# EAGLE design SEGmeter20XBeeShield (EAGLE 5.11)
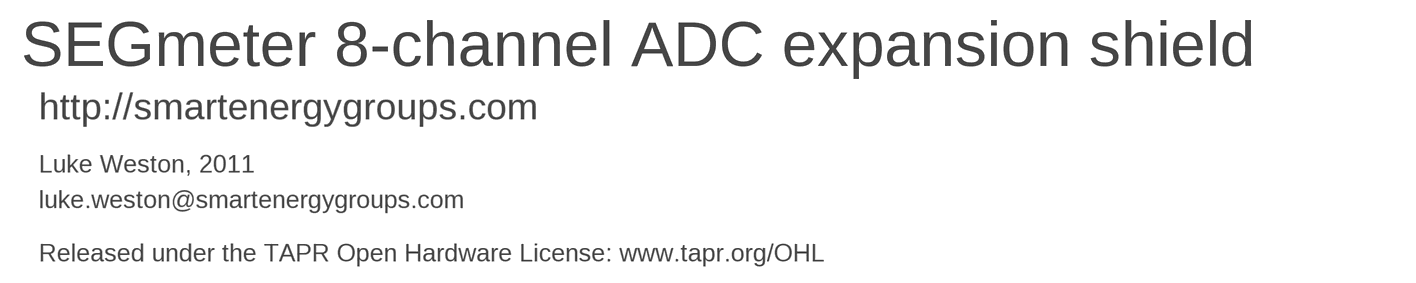
[diagram p0: schematic, sheet 1, part 1 of 3]
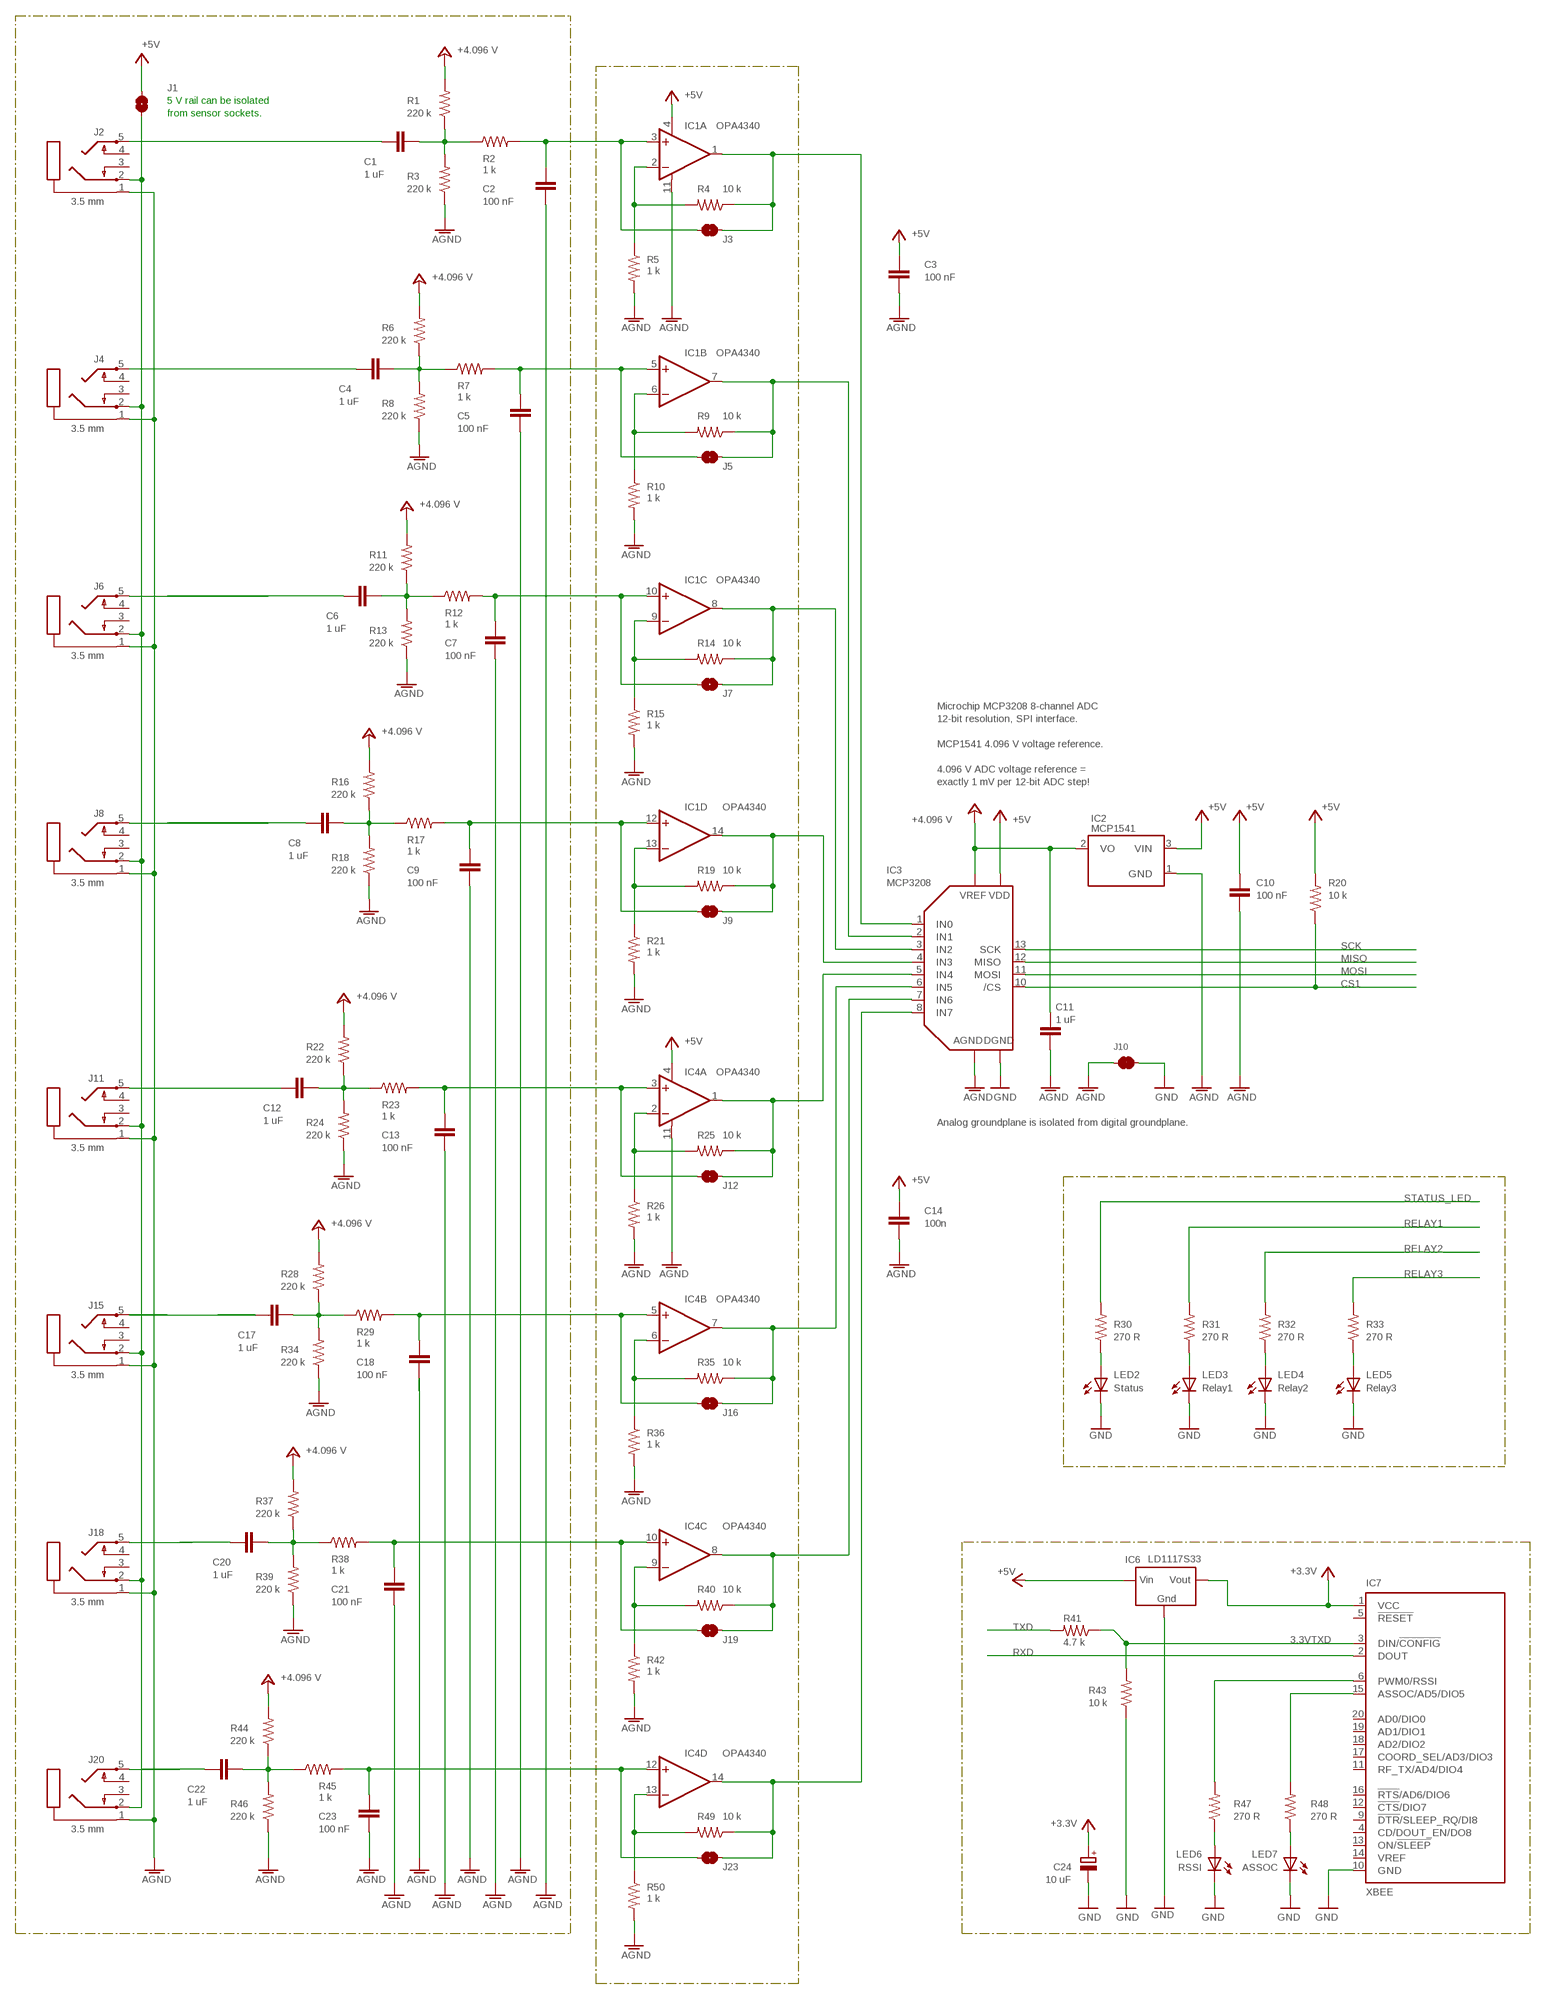
[diagram p1: schematic, sheet 1, part 2 of 3]
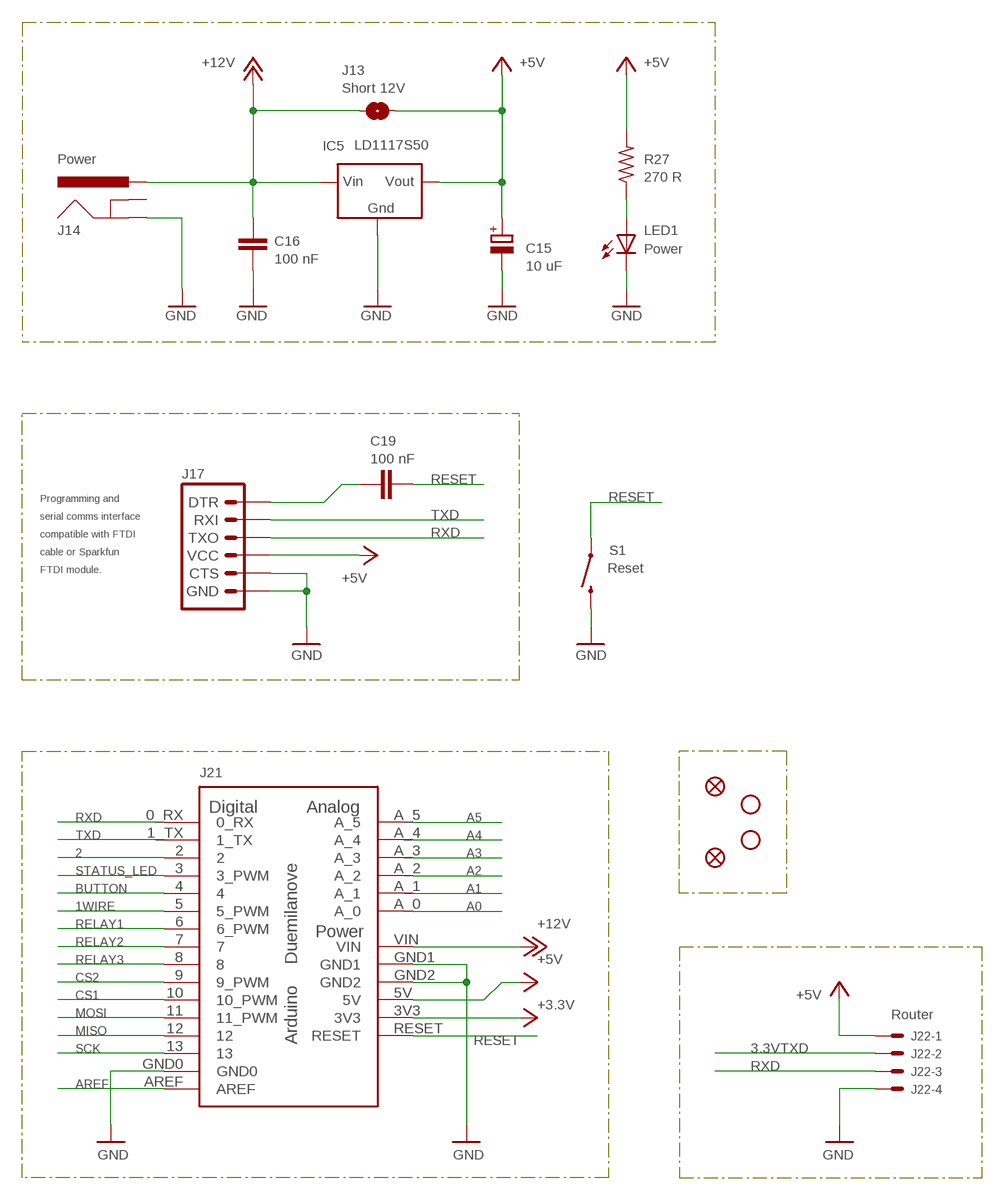
[diagram p2: schematic, sheet 1, part 3 of 3]

## Parts
C1  1 uF  C-EU050-024X044  [C050-024X044]
C2  100 nF  C-EU050-024X044  [C050-024X044]
C3  100 nF  C-EU050-024X044  [C050-024X044]
C4  1 uF  C-EU050-024X044  [C050-024X044]
C5  100 nF  C-EU050-024X044  [C050-024X044]
C6  1 uF  C-EU050-024X044  [C050-024X044]
C7  100 nF  C-EU050-024X044  [C050-024X044]
C8  1 uF  C-EU050-024X044  [C050-024X044]
C9  100 nF  C-EU050-024X044  [C050-024X044]
C10  100 nF  C-EU050-024X044  [C050-024X044]
C11  1 uF  C-EU050-024X044  [C050-024X044]
C12  1 uF  C-EU050-024X044  [C050-024X044]
C13  100 nF  C-EU050-024X044  [C050-024X044]
C14  100n  C-EU050-024X044  [C050-024X044]
C15  10 uF  CPOL-EUE2.5-5  [E2,5-5]
C16  100 nF  C-EU050-024X044  [C050-024X044]
C17  1 uF  C-EU050-024X044  [C050-024X044]
C18  100 nF  C-EU050-024X044  [C050-024X044]
C19  100 nF  C-EU050-024X044  [C050-024X044]
C20  1 uF  C-EU050-024X044  [C050-024X044]
C21  100 nF  C-EU050-024X044  [C050-024X044]
C22  1 uF  C-EU050-024X044  [C050-024X044]
C23  100 nF  C-EU050-024X044  [C050-024X044]
C24  10 uF  CPOL-EUE2.5-5  [E2,5-5]
IC1  OPA4340  OPA4340U  [SO14]
IC2  MCP1541  MC1541TO  [TO92]
IC3  MCP3208  [DIL16]
IC4  OPA4340  OPA4340U  [SO14]
IC5  LD1117S50  REG1117  [SOT223]
IC6  LD1117S33  REG1117  [SOT223]
IC7  XBEE  [XBEE-PRO]
J1  SJ  [SJ]
J2  3.5 mm  PG203J  [PG203J]
J3  SJ  [SJ]
J4  3.5 mm  PG203J  [PG203J]
J5  SJ  [SJ]
J6  3.5 mm  PG203J  [PG203J]
J7  SJ  [SJ]
J8  3.5 mm  PG203J  [PG203J]
J9  SJ  [SJ]
J10  SJ-NC  [SJ-NC]
J11  3.5 mm  PG203J  [PG203J]
J12  SJ  [SJ]
J13  Short 12V  SJ  [SJ]
J14  Power  POWER_JACKSLT  [POWER_JACK_SLOT]
J15  3.5 mm  PG203J  [PG203J]
J16  SJ  [SJ]
J17  Comms  ARDUINO_SERIAL_PROGRAMLONGPADS  [1X06_LONGPADS]
J18  3.5 mm  PG203J  [PG203J]
J19  SJ  [SJ]
J20  3.5 mm  PG203J  [PG203J]
J21  ARDUINO-USBNO-OUTLINE-NO-TEXT-OCTAGONAL  [NO-OUTLINE-OCTAGONAL-NOTEXT]
J22  Router  22-23-2041  [22-23-2041]
J23  SJ  [SJ]
JP1  FIDUCIAL1.5X3  [FIDUCIAL-1.5X3]
JP2  STAND-OFF  [STAND-OFF]
JP4  STAND-OFF  [STAND-OFF]
JP5  FIDUCIAL1.5X3  [FIDUCIAL-1.5X3]
LED1  Power  3MMLED  [3MMLED]
LED2  Status  3MMLED  [3MMLED]
LED3  Relay1  3MMLED  [3MMLED]
LED4  Relay2  3MMLED  [3MMLED]
LED5  Relay3  3MMLED  [3MMLED]
LED6  RSSI  3MMLED  [3MMLED]
LED7  ASSOC  3MMLED  [3MMLED]
R1  220 k  R-US_0207/10  [0207/10]
R2  1 k  R-US_0207/10  [0207/10]
R3  220 k  R-US_0207/10  [0207/10]
R4  10 k  R-US_0207/10  [0207/10]
R5  1 k  R-US_0207/10  [0207/10]
R6  220 k  R-US_0207/10  [0207/10]
R7  1 k  R-US_0207/10  [0207/10]
R8  220 k  R-US_0207/10  [0207/10]
R9  10 k  R-US_0207/10  [0207/10]
R10  1 k  R-US_0207/10  [0207/10]
R11  220 k  R-US_0207/10  [0207/10]
R12  1 k  R-US_0207/10  [0207/10]
R13  220 k  R-US_0207/10  [0207/10]
R14  10 k  R-US_0207/10  [0207/10]
R15  1 k  R-US_0207/10  [0207/10]
R16  220 k  R-US_0207/10  [0207/10]
R17  1 k  R-US_0207/10  [0207/10]
R18  220 k  R-US_0207/10  [0207/10]
R19  10 k  R-US_0207/10  [0207/10]
R20  10 k  R-US_0207/10  [0207/10]
R21  1 k  R-US_0207/10  [0207/10]
R22  220 k  R-US_0207/10  [0207/10]
R23  1 k  R-US_0207/10  [0207/10]
R24  220 k  R-US_0207/10  [0207/10]
R25  10 k  R-US_0207/10  [0207/10]
R26  1 k  R-US_0207/10  [0207/10]
R27  270 R  R-US_0207/10  [0207/10]
R28  220 k  R-US_0207/10  [0207/10]
R29  1 k  R-US_0207/10  [0207/10]
R30  270 R  R-US_0207/10  [0207/10]
R31  270 R  R-US_0207/10  [0207/10]
R32  270 R  R-US_0207/10  [0207/10]
R33  270 R  R-US_0207/10  [0207/10]
R34  220 k  R-US_0207/10  [0207/10]
R35  10 k  R-US_0207/10  [0207/10]
R36  1 k  R-US_0207/10  [0207/10]
R37  220 k  R-US_0207/10  [0207/10]
R38  1 k  R-US_0207/10  [0207/10]
R39  220 k  R-US_0207/10  [0207/10]
R40  10 k  R-US_0207/10  [0207/10]
R41  4.7 k  R-US_0207/10  [0207/10]
R42  1 k  R-US_0207/10  [0207/10]
R43  10 k  R-US_0207/10  [0207/10]
R44  220 k  R-US_0207/10  [0207/10]
R45  1 k  R-US_0207/10  [0207/10]
R46  220 k  R-US_0207/10  [0207/10]
R47  270 R  R-US_0207/10  [0207/10]
R48  270 R  R-US_0207/10  [0207/10]
R49  10 k  R-US_0207/10  [0207/10]
R50  1 k  R-US_0207/10  [0207/10]
S1  Reset  SWITCH-MOMENTARY-2PTH  [TACTILE-PTH]

## Nets
1WIRE: J21.5(5_PWM)
2: J21.2
3.3VTXD: IC7.3(DIN/!CONFIG) J22.2 R41.1 R43.2
+3.3V: C24.+ IC6.2(VOUT) IC7.1(VCC) J21.3V3
+4.096V: C11.2 IC2.2(VO) IC3.15(VREF) R1.2 R6.2 R11.2 R16.2 R22.2 R28.2 R37.2 R44.2 ; supply symbol labelled +4.096 V
+5V: C3.2 C10.2 C14.2 C15.+ IC1.4(A:V+) IC2.3(VIN) IC3.16(VDD) IC4.4(A:V+) IC5.2(VOUT) IC6.3(VIN) J1.2 J13.2 J17.4(VCC) J21.5V J22.1 R20.2 R27.2
+12V: C16.2 IC5.3(VIN) J13.1 J14.PWR J21.VIN
A0: J21.A_0
A1: J21.A_1
A2: J21.A_2
A3: J21.A_3
A4: J21.A_4
A5: J21.A_5
AGND: C2.1 C3.1 C5.1 C7.1 C9.1 C10.1 C11.1 C13.1 C14.1 C18.1 C21.1 C23.1 IC1.11(A:V-) IC2.1(GND) IC3.14(AGND) IC4.11(A:V-) J2.1 J4.1 J6.1 J8.1 J10.1 J11.1 J15.1 J18.1 J20.1 R3.1 R5.2 R8.1 R10.2 R13.1 R15.2 R18.1 R21.2 R24.1 R26.2 R34.1 R36.2 R39.1 R42.2 R46.1 R50.2
AREF: J21.AREF
BUTTON: J21.4
CS1: IC3.10(/CS) J21.10(10_PWM) R20.1
CS2: J21.9(9_PWM)
GND: C15.- C16.1 C24.- IC3.9(DGND) IC5.1(GND) IC6.1(GND) IC7.10(GND) J10.2 J14.GND@2(GND) J17.5(CTS) J17.6(GND) J21.GND0 J21.GND1 J21.GND2 J22.4 LED1.K(C) LED2.K(C) LED3.K(C) LED4.K(C) LED5.K(C) LED6.K(C) LED7.K(C) R43.1 S1.3
MISO: IC3.12(MISO) J21.12
MOSI: IC3.11(MOSI) J21.11(11_PWM)
N$1: LED2.A R30.1
N$2: C20.1 J18.5
N$3: C22.1 J20.5
N$4: LED3.A R31.1
N$5: LED4.A R32.1
N$6: IC1.2(A:-IN) R4.2 R5.1
N$7: C17.1 J15.5
N$8: C12.1 J11.5
N$9: C8.1 J8.5
N$11: LED5.A R33.1
N$12: C6.1 J6.5
N$13: IC1.6(B:-IN) R9.2 R10.1
N$15: IC1.1(A:OUT) IC3.1(IN0) J3.1 R4.1
N$16: IC1.7(B:OUT) IC3.2(IN1) J5.1 R9.1
N$17: IC1.9(C:-IN) R14.2 R15.1
N$19: IC1.8(C:OUT) IC3.3(IN2) J7.1 R14.1
N$20: C7.2 IC1.10(C:+IN) J7.2 R12.2
N$23: LED1.A R27.1
N$25: IC7.6(PWM0/RSSI) R47.2
N$28: IC7.15(ASSOC/AD5/DIO5) R48.2
N$29: LED7.A R48.1
N$30: C19.1 J17.1(DTR)
N$31: LED6.A R47.1
N$38: C2.2 IC1.3(A:+IN) J3.2 R2.2
N$40: IC1.13(D:-IN) R19.2 R21.1
N$41: IC1.14(D:OUT) IC3.4(IN3) J9.1 R19.1
N$42: C9.2 IC1.12(D:+IN) J9.2 R17.2
N$43: IC4.2(A:-IN) R25.2 R26.1
N$44: IC3.5(IN4) IC4.1(A:OUT) J12.1 R25.1
N$45: C5.2 IC1.5(B:+IN) J5.2 R7.2
N$46: C13.2 IC4.3(A:+IN) J12.2 R23.2
N$47: IC4.6(B:-IN) R35.2 R36.1
N$48: IC3.6(IN5) IC4.7(B:OUT) J16.1 R35.1
N$49: C18.2 IC4.5(B:+IN) J16.2 R29.2
N$50: IC4.9(C:-IN) R40.2 R42.1
N$51: IC3.7(IN6) IC4.8(C:OUT) J19.1 R40.1
N$52: C21.2 IC4.10(C:+IN) J19.2 R38.2
N$53: IC4.13(D:-IN) R49.2 R50.1
N$54: IC3.8(IN7) IC4.14(D:OUT) J23.1 R49.1
N$55: C23.2 IC4.12(D:+IN) J23.2 R45.2
N$56: C1.2 R1.1 R2.1 R3.2
N$57: C1.1 J2.5
N$58: C4.2 R6.1 R7.1 R8.2
N$60: C6.2 R11.1 R12.1 R13.2
N$61: C4.1 J4.5
N$63: C8.2 R16.1 R17.1 R18.2
N$65: C12.2 R22.1 R23.1 R24.2
N$67: C17.2 R28.1 R29.1 R34.2
N$68: C22.2 R44.1 R45.1 R46.2
N$69: J1.1 J2.2 J4.2 J6.2 J8.2 J11.2 J15.2 J18.2 J20.2
N$70: C20.2 R37.1 R38.1 R39.2
RELAY1: J21.6(6_PWM) R31.2
RELAY2: J21.7 R32.2
RELAY3: J21.8 R33.2
RESET: C19.2 J21.RESET S1.1
RXD: IC7.2(DOUT) J17.3(TXO) J21.0_RX J22.3
SCK: IC3.13(SCK) J21.13
STATUS_LED: J21.3(3_PWM) R30.2
TXD: J17.2(RXI) J21.1_TX R41.2
Unconnected: IC7.4(CD/DOUT_EN/DO8) IC7.5(!RESET) IC7.9(!DTR!/SLEEP_RQ/DI8) IC7.11(RF_TX/AD4/DIO4) IC7.12(!CTS!/DIO7) IC7.13(ON/!SLEEP) IC7.14(VREF) IC7.16(!RTS!/AD6/DIO6) IC7.17(COORD_SEL/AD3/DIO3) IC7.18(AD2/DIO2) IC7.19(AD1/DIO1) IC7.20(AD0/DIO0) J2.3 J2.4 J4.3 J4.4 J6.3 J6.4 J8.3 J8.4 J11.3 J11.4 J14.GND@1(GNDBREAK) J15.3 J15.4 J18.3 J18.4 J20.3 J20.4

## Notes on the sheet
- SEGmeter 8-channel ADC expansion shield
- http://smartenergygroups.com
- Luke Weston, 2011
- luke.weston@smartenergygroups.com
- Released under the TAPR Open Hardware License: www.tapr.org/OHL
- 5 V rail can be isolated
- from sensor sockets.
- Microchip MCP3208 8-channel ADC
- 12-bit resolution, SPI interface.
- MCP1541 4.096 V voltage reference.
- 4.096 V ADC voltage reference =
- exactly 1 mV per 12-bit ADC step!
- Analog groundplane is isolated from digital groundplane.
- Programming and
- serial comms interface
- compatible with FTDI
- cable or Sparkfun
- FTDI module.

## Library data of the parts
C1-C14 C16-C23 = rcl:C-EU: CAPACITOR, European symbol
C15 C24 = rcl:CPOL-EU: POLARIZED CAPACITOR, European symbol
IC1 IC4 = burr-brown:OPA4340: Operational Amplifiers Source: http://focus.ti.com/lit/ds/sbos073/sbos073.pdf; MF: TEXAS INSTRUMENTS; MPN: OPA4340UA; OC_FARNELL: 1212307; OC_NEWARK: 35C1907
IC2 = microchip:MC15*: 2.5V and 4.096V Voltage References Source: http://www.microchip.com .. 21653b.pdf; OC_FARNELL: unknown; OC_NEWARK: unknown
IC3 = Luke:MCP3208
IC5 IC6 = burr-brown:REG1117: 800mA and 1A Low Dropout (LDO) Positive Regulator 1.8V, 2.5V, 2.85V, 3.3V, 5V, and Adj; MPN: REG1117; OC_FARNELL: 1097566; OC_NEWARK: 14P6981
IC7 = Luke:XBEE
J1 J3 J5 J7 J9 J12 J13 J16 J19 J23 = jumper:SJ: SMD solder JUMPER
J2 J4 J6 J8 J11 J15 J18 J20 = con-hirschmann:PG203J: MIC/HEADPHONE JACK KS-S stereo microphone/headphone jack PG203JN (Schukat); OC_FARNELL: unknown; OC_NEWARK: unknown
J10 = Luke:SJ-NC
J14 = SparkFun:POWER_JACK: Power Jack This is the standard 5.5mm barrel jack for power. The PTH is the most common, proven, reliable, footprint. All others are experimental. The Slot footprint only works if the mill layer is transmitted to the PCB fab house so be warned. Spark Fun Electronics SKU : PRT-00119. Mating wall wart : TOL-00298 (and others)
J17 = SparkFun:ARDUINO_SERIAL_PROGRAM
J21 = Arduino-Various:ARDUINO-USB: The Ardiuno Duemilanove Pinouts layoutet as a Bare Shield. v0.5 Also for Arduino Diecimila. This is designed as a Part and has no Outline in the Dimension Layer. The Outline, when present, is drawed at the tPlace / bPlace Layer. Library by Stephanie Lange, http://www.k-ita.de/~sl/
J22 = con-molex:22-23-2041: .100" (2.54mm) Center Header - 4 Pin; MF: MOLEX; MPN: 22-23-2041; OC_FARNELL: 1462920; OC_NEWARK: 38C0355
JP1 JP5 = SparkFun:FIDUCIAL: Fiducial Alignment Points Various fiducial points for machine vision alignment.
JP2 JP4 = SparkFun:STAND-OFF: Stand Off This is the mechanical footprint for a #4 phillips button head screw. Use the keepout ring to avoid running the screw head into surrounding components. SKU : PRT-00447
LED1-LED7 = Luke:3MMLED
R1-R50 = rcl:R-US_: RESISTOR, American symbol
S1 = SparkFun:SWITCH-MOMENTARY-2

## Board
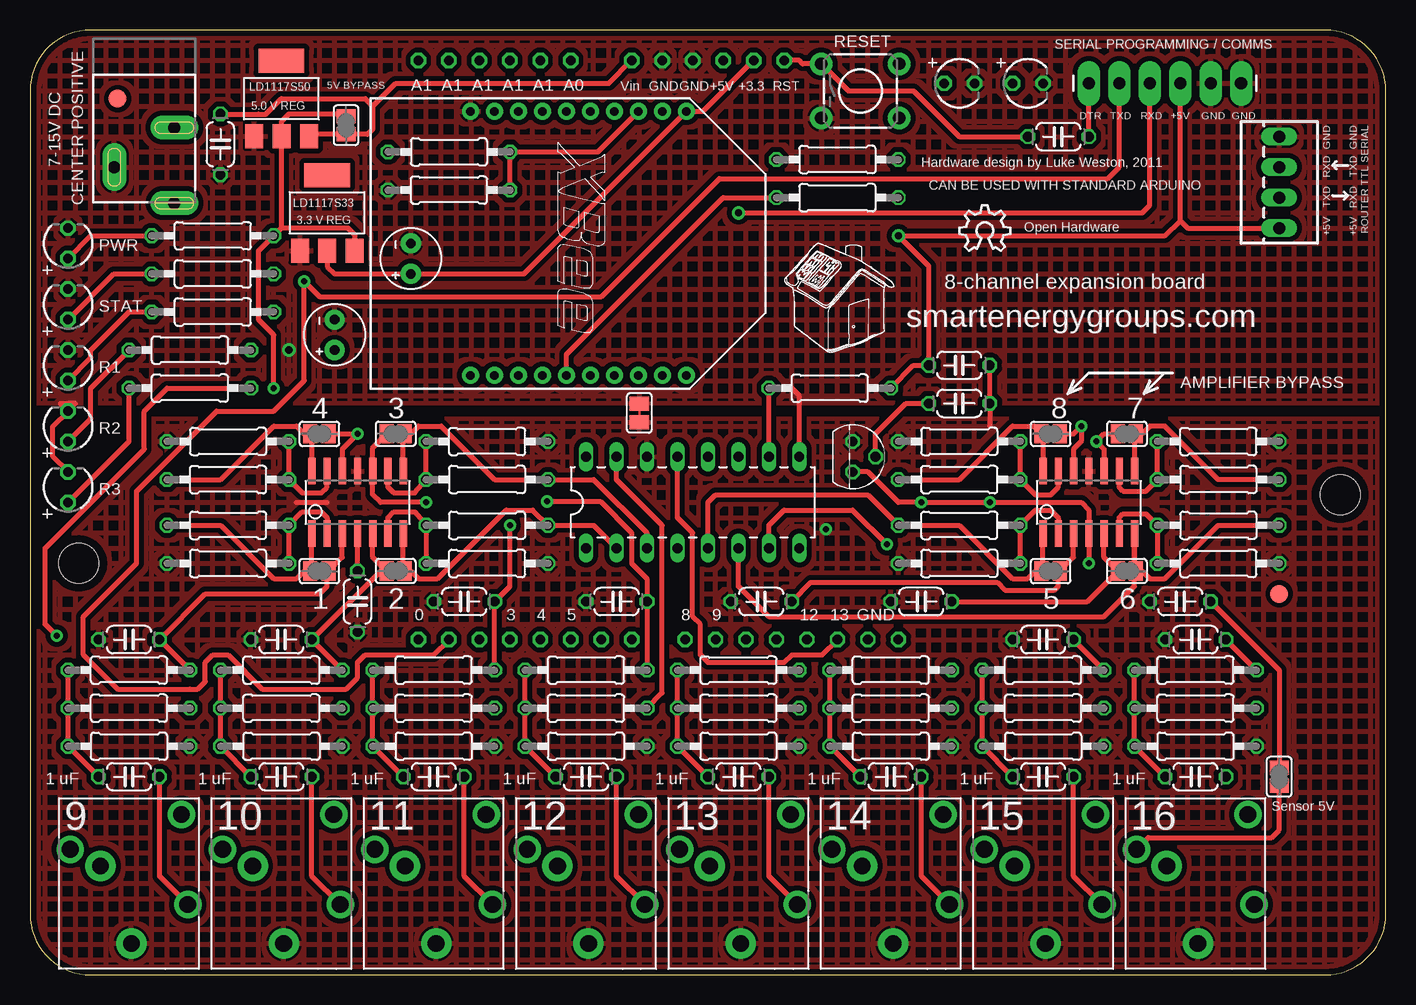
[diagram p3: board, top side]
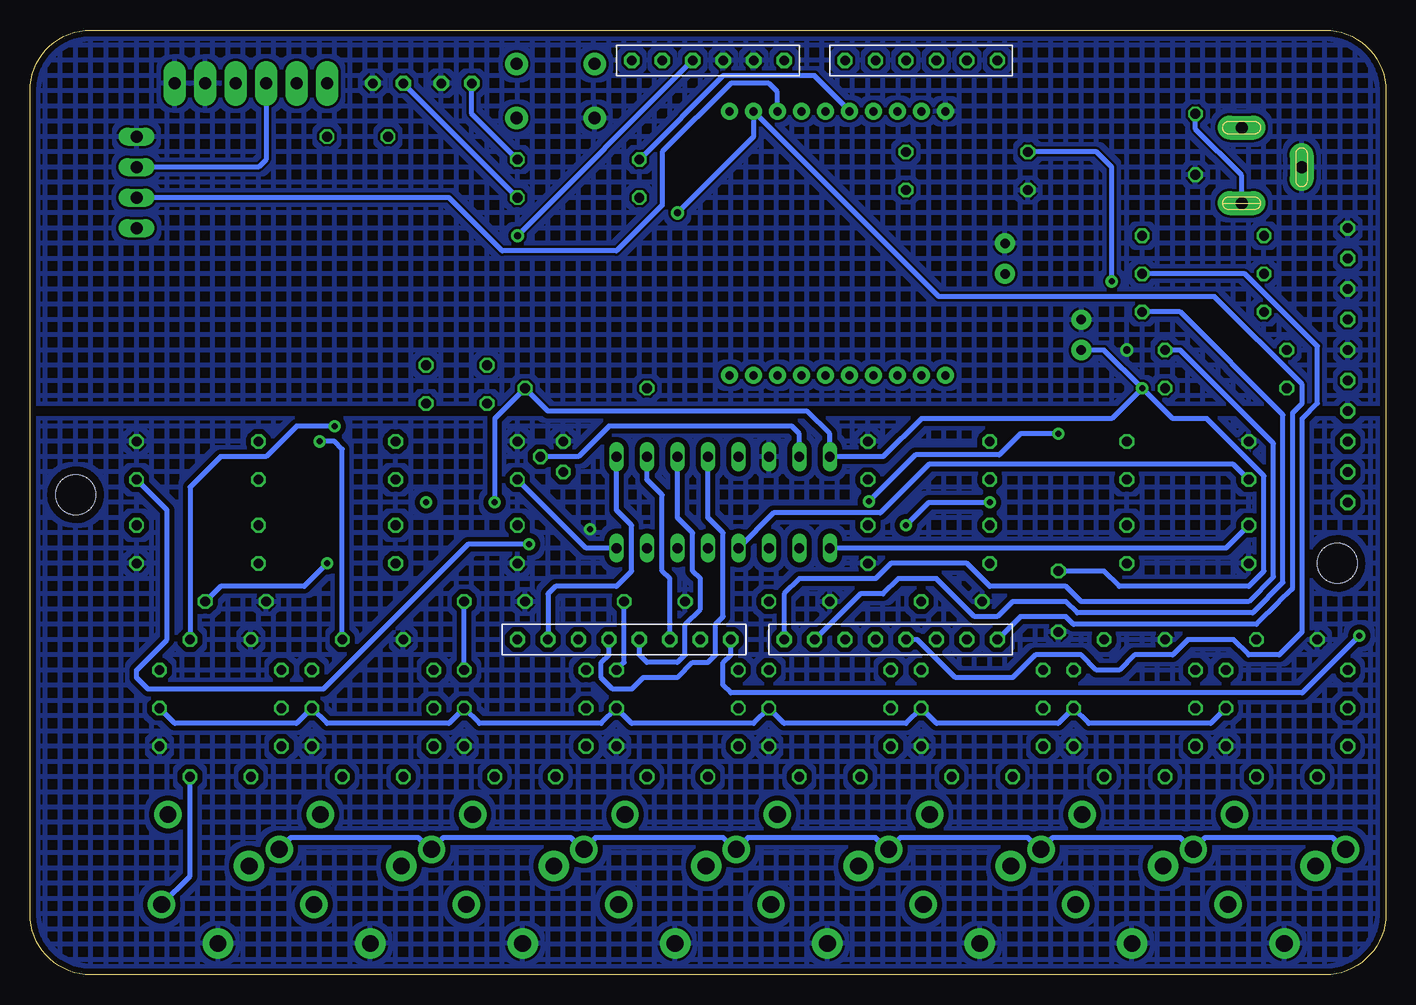
[diagram p4: board, bottom side, seen from below]

Size 113.03 x 78.74 mm. Coordinates in mm from the lower left corner, seen from the top.
Outline: 107.95,0 arc90 113.03,5.08 113.03,73.66 arc90 107.95,78.74 5.08,78.74 arc90 0,73.66 0,5.08 arc90 5.08,0 107.95,0
Copper layers (1*16): Top 0.035mm / dielectric 1.5mm / Bottom 0.035mm
Design rules "PCBCart-Standard": minimum track width 8mil, minimum drill 0.4mm, track to track 8mil, track to pad 8mil, pad to pad 8mil, via to via 8mil, smd to smd 8mil, copper to edge 20mil, drill to drill 8mil, minimum pad ring 8mil, minimum via ring 10mil, stop-mask expansion 3mil, vias tented up to drill 0mil, thermal gap 8mil

### Footprints (pad centres in the part's own frame; a part is rotated, then mirrored left to right if it is on the bottom)
C050-024X044 = drill 0.813 octagon: 1 -2.54,0; 2 2.54,0
E2,5-5 = drill 0.8 pad 1.676 round: + -1.27,0; - 1.27,0
SO14 = smd 0.61 x 2.21: 1 -3.81,-2.603; 2 -2.54,-2.603; 3 -1.27,-2.603; 4 0,-2.603; 5 1.27,-2.603; 6 2.54,-2.603; 7 3.81,-2.603; 8 3.81,2.603; 9 2.54,2.603; 10 1.27,2.603; 11 0,2.603; 12 -1.27,2.603; 13 -2.54,2.603; 14 -3.81,2.603
TO92 = drill 0.813 octagon: 1 -1.27,0; 2 0,1.905; 3 1.27,0
DIL16 = drill 0.813 long: 1 -8.89,-3.81; 2 -6.35,-3.81; 3 -3.81,-3.81; 4 -1.27,-3.81; 5 1.27,-3.81; 6 3.81,-3.81; 7 6.35,-3.81; 8 8.89,-3.81; 9 8.89,3.81; 10 6.35,3.81; 11 3.81,3.81; 12 1.27,3.81; 13 -1.27,3.81; 14 -3.81,3.81; 15 -6.35,3.81; 16 -8.89,3.81
SOT223 = smd 1.499 x 2.007: 1 -2.261,-3.15; 2 0.025,-3.15; 3 2.311,-3.15 | smd 3.81 x 2.007: 4 0,3.15
XBEE-PRO = drill 0.7 pad 1.422 round: 1 -11,10.27; 2 -11,8.27; 3 -11,6.27; 4 -11,4.27; 5 -11,2.27; 6 -11,0.27; 7 -11,-1.73; 8 -11,-3.73; 9 -11,-5.73; 10 -11,-7.73; 11 11,-7.73; 12 11,-5.73; 13 11,-3.73; 14 11,-1.73; 15 11,0.27; 16 11,2.27; 17 11,4.27; 18 11,6.27; 19 11,8.27; 20 11,10.27
SJ = smd 1.168 x 1.6: 1 -0.762,0; 2 0.762,0
PG203J = drill 1.4 pad 2.54 round: 1 -5.004,-0.203; 3 1.448,2.388 | drill 1.4 pad 2.286 round: 2 2.845,4.902; 4 5.74,-4.369; 5 -1.753,-4.902
SJ-NC = smd 1.168 x 1.6: 1 -0.762,0; 2 0.762,0
POWER_JACK_SLOT = drill 1 pad 2 long: GND@1 2.58,7.5; GND@2 7.58,10.8; PWR 2.58,13.8
1X06_LONGPADS = drill 1.016 pad 1.88 long: 1 0,0; 2 2.54,0; 3 5.08,0; 4 7.62,0; 5 10.16,0; 6 12.7,0
NO-OUTLINE-OCTAGONAL-NOTEXT = drill 0.8 pad 1.27 octagon: 0_RX -25.4,27.94; 1_TX -25.4,25.4; 2 -25.4,22.86; 3 -25.4,20.32; 3V3 22.86,0; 4 -25.4,17.78; 5 -25.4,15.24; 5V 22.86,2.54; 6 -25.4,12.7; 7 -25.4,10.16; 8 -25.4,5.715; 9 -25.4,3.175; 10 -25.4,0.635; 11 -25.4,-1.905; 12 -25.4,-4.445; 13 -25.4,-6.985; A_0 22.86,15.24; A_1 22.86,17.78; A_2 22.86,20.32; A_3 22.86,22.86; A_4 22.86,25.4; A_5 22.86,27.94; AREF -25.4,-12.065; GND0 -25.4,-9.525; GND1 22.86,7.62; GND2 22.86,5.08; RESET 22.86,-2.54; VIN 22.86,10.16
22-23-2041 = drill 1 long: 1 -3.81,0; 2 -1.27,0; 3 1.27,0; 4 3.81,0
FIDUCIAL-1.5X3 = smd 1.5 x 1.5: 1 0,0
STAND-OFF = hole 3.302: 0,0
3MMLED = drill 0.8 pad 1.27 octagon: A -1.27,0; K 1.27,0
0207/10 = drill 0.813 octagon: 1 -5.08,0; 2 5.08,0
TACTILE-PTH = drill 1.016 pad 1.88 round: 1 -3.251,2.261; 2 3.251,2.261; 3 -3.251,-2.261; 4 3.251,-2.261

### Placement (x,y rotation side)
C1  8.25,16.51 180 top
C2  8.25,27.94 0 top
C3  27.3,31.11 90 top
C4  20.95,16.51 180 top
C5  20.95,27.94 0 top
C6  33.66,16.51 180 top
C7  36.2,31.11 0 top
C8  46.35,16.51 180 top
C9  48.89,31.11 0 top
C10  77.47,50.8 180 top
C11  77.47,47.62 180 top
C12  59.05,16.51 180 top
C13  60.96,31.11 0 top
C14  95.89,31.11 0 top
C15  25.4,53.34 90 top
C16  15.88,69.22 90 top
C17  71.76,16.51 180 top
C18  74.3,31.11 0 top
C19  85.72,69.85 180 top
C20  84.46,16.51 180 top
C21  84.46,27.94 0 top
C22  97.16,16.51 180 top
C23  97.16,27.94 0 top
C24  31.75,59.69 90 top
IC1  27.3,39.37 0 top
IC2  68.58,43.18 270 top
IC3  55.24,39.37 0 top
IC4  88.27,39.37 0 top
IC5  20.95,73.03 0 top
IC6  24.77,63.5 0 top
IC7  44.45,60.96 270 top
J1  104.14,16.51 90 top
J2  8.25,7.62 90 top
J3  24.13,33.66 0 top
J4  20.95,7.62 90 top
J5  30.48,33.66 180 top
J6  33.66,7.62 90 top
J7  30.48,45.09 180 top
J8  46.35,7.62 90 top
J9  24.13,45.09 0 top
J10  50.8,46.83 90 top
J11  59.05,7.62 90 top
J12  85.09,33.66 0 top
J13  26.35,70.8 90 top
J14  14.61,78.11 180 top
J15  71.76,7.62 90 top
J16  91.44,33.66 180 top
J17  88.27,74.3 0 top
J18  84.46,7.62 90 top
J19  91.44,45.09 180 top
J20  97.16,7.62 90 top
J21  60.32,53.34 90 top
J22  104.14,66.04 90 top
J23  85.09,45.09 0 top
JP1  7.3,73.03 0 top
JP2  4.06,34.29 0 top
JP4  109.22,40.01 0 top
JP5  104.14,31.75 0 top
LED1  3.17,60.96 90 top
LED2  3.17,55.88 90 top
LED3  3.17,50.8 90 top
LED4  3.17,45.72 90 top
LED5  3.17,40.64 90 top
LED6  77.47,74.3 0 top
LED7  83.19,74.3 0 top
R1  8.25,22.22 0 top
R2  8.25,25.4 0 top
R3  8.25,19.05 180 top
R4  16.51,37.46 0 top
R5  16.51,34.29 180 top
R6  20.95,22.22 0 top
R7  20.95,25.4 0 top
R8  20.95,19.05 180 top
R9  38.1,37.46 180 top
R10  38.1,34.29 0 top
R11  33.66,22.22 0 top
R12  33.66,25.4 0 top
R13  33.66,19.05 180 top
R14  38.1,41.27 180 top
R15  38.1,44.45 0 top
R16  46.35,22.22 0 top
R17  46.35,25.4 0 top
R18  46.35,19.05 180 top
R19  16.51,41.27 0 top
R20  66.68,48.89 0 top
R21  16.51,44.45 180 top
R22  59.05,22.22 0 top
R23  59.05,25.4 0 top
R24  59.05,19.05 180 top
R25  77.47,37.46 0 top
R26  77.47,34.29 180 top
R27  15.24,61.59 0 top
R28  71.76,22.22 0 top
R29  71.76,25.4 0 top
R30  15.24,58.42 0 top
R31  15.24,55.24 0 top
R32  13.34,52.07 0 top
R33  13.34,48.89 0 top
R34  71.76,19.05 180 top
R35  99.06,37.46 180 top
R36  99.06,34.29 0 top
R37  84.46,22.22 0 top
R38  84.46,25.4 0 top
R39  84.46,19.05 180 top
R40  99.06,41.27 180 top
R41  34.92,68.58 180 top
R42  99.06,44.45 0 top
R43  34.92,65.41 0 top
R44  97.16,22.22 0 top
R45  97.16,25.4 0 top
R46  97.16,19.05 180 top
R47  67.31,67.95 180 top
R48  67.31,64.77 180 top
R49  77.47,41.27 0 top
R50  77.47,44.45 180 top
S1  69.22,73.66 0 top
U$2  [OSHW_8X150_NOTEXT]  77.47,60.32 0 top

### Tracks (layer width: path | path; a pad name or v marks a point on that pad's centre or on a via)
3.3VTXD
  Top 0.406: IC7.3 47.34,68.58 R41.1 R43.2
  Bottom 0.406: IC7.3 50.72,73.58 51.44,74.3 54.61,74.3 60.32,68.58 60.32,64.14 64.14,60.32 73.66,60.32 78.11,64.77 J22.2
+3.3V
  Top 0.406: IC6.2 24.79,59.03 25.4,58.42 C24.+ 41.18,58.42 IC7.1 56.09,71.96 J21.3V3
+4.096V
  Top 0.406: R16.2 52.7,23.49 52.7,37.46 48.89,41.27 IC3.15 | C11.2 73.03,47.62 70.48,45.09 IC2.2
  Bottom 0.406: R1.2 14.61,20.95 24.77,20.95 R6.2 27.3,20.95 37.46,20.95 R11.2 40.01,20.95 50.16,20.95 R16.2 52.7,20.95 62.87,20.95 R22.2 65.41,20.95 75.57,20.95 R28.2 78.11,20.95 88.27,20.95 R37.2 90.81,20.95 100.97,20.95 R44.2 | IC3.15 48.89,45.09 49.53,45.72 64.77,45.72 67.31,43.18 IC2.2
+5V  (via drill 0.5, 0.6)
  Top 0.406: J1.2 104.14,25.4 C14.2 | v88.27,34.29 IC4.4 88.27,38.73 87.63,39.37 v80.01,39.37 v74.3,39.37 72.39,39.37 69.85,41.91 IC2.3 | J13.2 26.16,71.76 21.59,71.76 20.98,71.15 IC5.2 20.98,62.26 | v20.32,48.89 20.32,53.34 19.05,54.61 19.05,60.32 R27.2 20.98,62.26 | R20.2 73.66,50.8 C10.2 74.93,59.05 v72.39,61.59 94.62,61.59 95.89,62.87 | 20.98,62.26 26.49,62.26 27.08,61.66 IC6.3 | 95.89,62.87 J17.4 | 95.89,62.87 96.52,62.23 J22.1 | C3.2 IC1.4
  Bottom 0.406: v88.27,34.29 90.17,32.38 97.16,32.38 C14.2 | v20.32,48.89 17.78,46.35 14.92,46.35 10.16,41.59 10.16,33.66 11.43,32.38 22.22,32.38 23.49,33.66 C3.2 | v20.32,48.89 22.86,46.35 38.73,46.35 41.91,43.18 IC3.16 46.35,45.09 48.26,46.99 69.85,46.99 R20.2 74.3,46.35 v74.3,39.37 | C15.+ 23.49,52.07 v20.32,48.89 | v72.39,61.59 J21.5V
+12V
  Top 0.406: IC5.3 23.43,70.04 J13.1 28.13,70.04 28.57,70.48 28.57,72.39 | 28.57,72.39 27.94,73.03 20.95,73.03 19.64,71.72 18.38,71.72 | 28.57,72.39 30.48,74.3 48.26,74.3 J21.VIN | 18.38,71.72 19.05,71.76 | 18.38,71.72 15.91,71.72 C16.2
  Bottom 0.406: J14.PWR 12.02,66.64 15.88,70.48 C16.2
AGND  (via drill 0.5)
  Top 0.406: 22.22,39.37 24.77,39.37 | C10.1 C11.1 80.01,45.72
  other vias: 66.36,37.15
  pour Bottom (isolate 0.406, hatched): -1.27,46.35 114.3,46.35 114.3,-0.63 -1.27,-0.63
  pour Top (isolate 0.406, hatched): -1.27,46.35 114.3,46.35 114.3,-0.63 -1.27,-0.63
CS1
  Top 0.406: IC3.10 R20.1
  Bottom 0.406: J21.10 59.69,33.02 60.32,33.66 60.32,40.01 61.59,41.27 IC3.10
GND  (via drill 0.6)
  Top 0.406: LED5.K 1.91,43.18 1.91,45.72 LED4.K | LED4.K 2.54,47.62 3.17,47.62 | 3.17,47.62 3.81,47.62 LED4.K | LED4.K 3.17,47.62 | IC3.9 64.14,48.26 63.5,48.89
  Bottom 0.406: IC3.9 64.14,38.73 62.87,37.46 62.87,33.66 64.14,32.38 69.22,32.38 69.85,31.75 J21.GND0
  other vias: 21.59,52.07
  pour Top (isolate 0.406, hatched): -1.27,80.01 114.3,80.01 114.3,47.62 -1.27,47.62
  pour Bottom (hatched): -1.27,80.01 114.3,80.01 114.3,47.62 -1.27,47.62
MISO
  Bottom 0.406: IC3.12 56.52,38.1 55.24,36.83 55.24,29.84 55.88,29.21 55.88,26.67 56.52,26.04 57.78,26.04 59.05,24.77 61.91,24.77 62.87,23.81 64.45,23.81 65.41,24.77 65.41,26.04 64.77,26.67 J21.12
MOSI
  Bottom 0.406: J21.11 62.23,26.67 61.59,26.04 59.05,26.04 58.42,26.67 58.42,29.21 57.15,30.48 57.15,33.02 57.78,33.66 57.78,36.83 59.05,38.1 IC3.11
N$1
  Top 0.406: R30.1 6.99,58.42 LED2.A
N$2
  Top 0.406: C20.1 87,8.23 J18.5
N$3
  Bottom 0.406: C22.1 99.7,8.23 J20.5
N$4
  Top 0.406: LED3.A 5.08,51.44 5.08,52.07 8.25,55.24 R31.1
N$5
  Top 0.406: LED4.A 5.08,46.35 5.08,48.89 R32.1
N$6
  Top 0.406: IC1.2 24.77,38.1 24.29,38.58 22.7,38.58 R4.2 R5.1
N$7
  Top 0.406: C17.1 74.3,8.23 J15.5
N$8
  Top 0.406: C12.1 61.59,8.23 J11.5
N$9
  Top 0.406: C8.1 48.89,8.23 J8.5
N$11
  Top 0.406: LED5.A 8.25,44.45 R33.1
N$12
  Top 0.406: C6.1 36.2,8.23 J6.5
N$13
  Top 0.406: R10.1 R9.2 32.07,38.58 30.32,38.58 29.84,38.1 IC1.6
N$15
  Top 0.406: R4.1 15.88,37.46 20.32,33.02 22.22,33.02 22.86,33.66 J3.1 23.49,33.78 IC1.1
  Bottom 0.406: R4.1 13.34,35.56 IC3.1
N$16
  Top 0.406: J5.1 31.24,33.46 | IC3.2 46.99,37.46 R9.1 41.91,38.73 39.69,38.73 33.97,33.02 32.38,33.02 31.75,33.66 J5.1 | IC1.7 31.11,33.78 J5.1
N$17
  Top 0.406: R15.1 R14.2 32.07,40.16 30.32,40.16 29.84,40.64 IC1.9
N$19
  Top 0.406: IC1.8 31.11,44.96 J7.1 31.75,45.09 32.38,45.72 34.29,45.72 38.73,41.27 R14.1 46.99,41.27 51.44,36.83 IC3.3
N$20  (via drill 0.5)
  Top 0.406: R12.2 C7.2 40.01,32.38 v40.01,37.46 | v33.02,39.37 29.21,39.37 28.57,40.01 IC1.10 28.57,43.94 J7.2
  Bottom 0.406: v33.02,39.37 38.1,39.37 v40.01,37.46
N$23
  Top 0.406: R27.1 5.08,61.59 LED1.A
N$25
  Bottom 0.406: IC7.6 44.72,72.03 47.62,74.93 55.24,74.93 R47.2
N$28
  Top 0.406: IC7.15 44.72,51.7 57.78,64.77 R48.2
N$29
  Bottom 0.406: R48.1 LED7.A
N$30
  Top 0.406: C19.1 J17.1 | C19.1
N$31
  Bottom 0.406: LED6.A 76.2,71.76 R47.1
N$38
  Top 0.406: R2.2 C2.2 14.61,31.75 24.13,31.75 24.77,32.38 24.77,33.53 J3.2 26.04,34.8 IC1.3
N$40
  Top 0.406: IC1.13 24.77,40.64 24.29,40.16 22.7,40.16 R19.2 R21.1
N$41
  Top 0.406: J9.1 23.34,45.05 | R19.1 15.88,41.27 20.32,45.72 22.22,45.72 22.86,45.09 J9.1 | IC1.14 23.49,44.96 J9.1
  Bottom 0.406: R19.1 12.7,42.55 38.1,42.55 42.15,38.5 51.04,38.5 IC3.4
N$42  (via drill 0.5)
  Top 0.406: R17.2 C9.2 51.44,33.02 50.16,34.29 50.16,36.83 47.55,39.45 v43.1,39.45 | IC1.12 26.04,43.81 v27.3,45.09 J9.2
  Bottom 0.406: v27.3,45.09 30.48,45.09 32.23,43.34 39.21,43.34 v43.1,39.45
N$43
  Top 0.406: R26.1 R25.2 83.82,38.73 85.09,38.73 85.73,38.1 IC4.2
N$44
  Top 0.406: IC4.1 84.46,33.78 J12.1 83.82,33.66 83.19,33.02 81.92,33.02 77.47,37.46 R25.1 69.85,40.01 57.15,40.01 56.52,39.37 IC3.5
N$45
  Top 0.406: R7.2 C5.2 29.21,33.66 J5.2 28.57,34.8 IC1.5
N$46
  Top 0.406: C13.2 65.09,32.7 80.65,32.7 81.28,32.07 85.41,32.07 85.73,32.38 85.73,33.53 J12.2 87,34.8 IC4.3
  Bottom 0.406: C13.2 63.5,26.04 R23.2
N$47
  Top 0.406: R36.1 R35.2 93.03,38.42 91.12,38.42 90.81,38.1 IC4.6
N$48
  Top 0.406: R35.1 99.06,37.46 94.62,33.02 93.35,33.02 92.71,33.66 J16.1 92.08,33.78 IC4.7 92.08,32.38 89.54,29.84 61.59,29.84 59.05,32.38 IC3.6
N$49
  Top 0.406: C18.2 88.14,31.11 J16.2 89.54,34.8 IC4.5
  Bottom 0.406: R29.2 C18.2
N$50
  Top 0.406: R42.1 R40.2 93.03,40.32 91.12,40.32 90.81,40.64 IC4.9
N$51  (via drill 0.5)
  Top 0.406: IC4.8 92.08,44.96 J19.1 92.71,45.09 93.35,45.72 94.62,45.72 99.06,41.27 R40.1 | IC3.7 61.59,37.46 62.87,38.73 68.58,38.73 v71.44,35.88
  Bottom 0.406: v71.44,35.88 76.52,35.88 88.58,23.81 103.19,23.81 104.14,24.77 104.14,25.4 101.6,27.94 101.6,38.73 R40.1
N$52  (via drill 0.5)
  Top 0.406: R38.2 C21.2 | IC4.10 89.54,43.81 v88.9,44.45 89.54,45.09 J19.2
  Bottom 0.406: v88.9,44.45 87.63,44.45 87,43.81 C21.2
N$53
  Top 0.406: R50.1 R49.2 83.82,40.01 85.09,40.01 85.73,40.64 IC4.13
N$54
  Top 0.406: IC4.14 84.46,44.96 J23.1 83.69,45.72 81.92,45.72 77.47,41.27 R49.1
  Bottom 0.406: IC3.8 66.68,35.56 R49.1
N$55  (via drill 0.5)
  Top 0.406: C23.2 R45.2 | IC4.12 87,43.81 87.63,44.45 v87.63,45.72 87,45.09 J23.2
  Bottom 0.406: v87.63,45.72 90.81,45.72 93.35,43.18 97.16,43.18 99.7,40.64 C23.2
N$56
  Top 0.406: C1.2 R3.2 R1.1 R2.1
N$57
  Top 0.406: C1.1 10.8,8.23 J2.5
N$58
  Top 0.406: C4.2 R8.2 R6.1 R7.1
N$60
  Top 0.406: C6.2 R13.2 28.57,21.59 R11.1 R12.1
N$61
  Top 0.406: C4.1 23.49,8.23 J4.5
N$63
  Top 0.406: C8.2 R18.2 R16.1 R17.1
N$65
  Top 0.406: C12.2 R24.2 R22.1 R23.1
N$67
  Top 0.406: C17.2 R34.2 R28.1 R29.1
N$68
  Top 0.406: R45.1 R44.1 R46.2 C22.2
N$69
  Top 0.406: J1.1 104.14,12.07 103.51,11.43 93.22,11.43 J20.2
  Bottom 0.406: J20.2 91.29,11.43 80.65,11.43 79.68,10.46 J18.2 78.59,11.43 67.95,11.43 66.98,10.46 J15.2 65.89,11.43 55.24,11.43 54.28,10.46 J11.2 53.19,11.43 42.55,11.43 41.58,10.46 J8.2 40.49,11.43 29.84,11.43 28.88,10.46 J6.2 27.79,11.43 17.14,11.43 16.18,10.46 J4.2 15.09,11.43 4.45,11.43 3.48,10.46 J2.2
N$70
  Top 0.406: C20.2 R39.2 R37.1 R38.1
RELAY1
  Bottom 0.406: J21.6 43.81,31.75 41.91,31.75 40.64,33.02 37.46,33.02 34.29,29.84 32.38,29.84 31.11,31.11 26.67,31.11 25.72,30.16 11.11,30.16 8.57,32.7 8.57,46.67 17.14,55.24 R31.2
RELAY2
  Bottom 0.406: J21.7 50.16,31.75 48.89,33.02 42.55,33.02 41.27,34.29 34.92,34.29 33.02,32.38 26.67,32.38 25.4,31.11 11.43,31.11 9.37,33.18 9.37,44.29 17.14,52.07 R32.2
RELAY3  (via drill 0.5)
  Top 0.406: R33.2 11.43,48.89 9.53,46.99 9.53,43.81 1.27,35.56 1.27,29.21 v2.22,28.26
  Bottom 0.406: J21.8 54.61,26.67 55.24,26.04 55.24,24.13 54.61,23.49 6.99,23.49 v2.22,28.26
RESET
  Top 0.406: J21.RESET 64.14,76.2 64.41,75.92 S1.1 68.22,73.66 73.66,73.66 77.47,69.85 C19.2
RXD  (via drill 0.6)
  Top 0.406: v59.05,63.5 92.71,63.5 93.35,64.14 J17.3
  Bottom 0.406: 8.89,31.11 10.8,29.21 26.04,29.21 26.67,29.84 30.48,29.84 J21.0_RX | 8.89,31.11 | 7.94,32.07 8.89,31.11 | 7.78,32.23 | 7.78,32.23 7.94,32.07 | 7.78,32.23 7.94,32.07 | 7.78,32.23 7.78,46.83 6.99,47.62 6.99,49.21 14.29,56.52 37.27,56.52 IC7.2 52.72,69.84 v59.05,63.5 | J17.3 93.35,67.95 93.98,67.31 J22.3
SCK
  Top 0.406: IC3.13 53.98,38.1 55.24,36.83 55.24,29.84 55.88,29.21 55.88,26.67 56.52,26.04 62.87,26.04 63.5,26.67 66.04,26.67 J21.13
STATUS_LED
  Bottom 0.406: J21.3 39.05,27.94 35.88,24.77 31.11,24.77 29.21,26.67 25.4,26.67 24.13,25.4 22.22,25.4 20.95,26.67 17.78,26.67 16.51,27.94 12.7,27.94 11.43,26.67 8.89,26.67 6.99,28.57 6.99,46.35 5.71,47.62 5.71,52.39 11.75,58.42 R30.2
TXD  (via drill 0.5)
  Top 0.406: J21.1_TX 33.66,26.67 27.94,26.67 27.3,26.04 27.3,24.77 26.35,23.81 19.37,23.81 16.51,26.67 15.24,26.67 14.61,26.04 14.61,24.45 13.97,23.81 13.34,23.81 7.3,23.81 4.45,26.67 4.45,29.84 8.89,34.29 8.89,40.32 15.56,46.99 20.32,46.99 22.86,49.53 v22.86,57.78 24.13,56.52 47.62,56.52 57.47,66.36 89.85,66.36 90.81,67.31 J17.2
  Bottom 0.406: R41.2 24.13,68.58 22.86,67.31 v22.86,57.78

### Text on the board
tPlace: RESET | SERIAL PROGRAMMING / COMMS | LD1117S50 | 5V BYPASS | A1 | A1 | A1 | A1 | A1 | A0 | Vin | GND | GND | +5V | +3.3 | RST | 5.0 V REG | DTR | TXD | RXD | +5V | GND | GND | GND | GND | ROUTER TTL SERIAL | RXD | TXD | 7-15V DC | Hardware design by Luke Weston, 2011 | CAN BE USED WITH STANDARD ARDUINO | TXD | RXD | CENTER POSITIVE | LD1117S33 | +5V | +5V | 3.3 V REG | Open Hardware | PWR | 8-channel expansion board | STAT | smartenergygroups.com | R1 | AMPLIFIER BYPASS | 4 | 3 | 8 | 7 | R2 | R3 | 1 | 2 | 5 | 6 | 0 | 3 | 4 | 5 | 8 | 9 | 12 | 13 | GND | 1 uF | 1 uF | 1 uF | 1 uF | 1 uF | 1 uF | 1 uF | 1 uF | Sensor 5V | 9 | 10 | 11 | 12 | 13 | 14 | 15 | 16